# EAGLE schematic LabAccessDC (EAGLE 9.2.1)
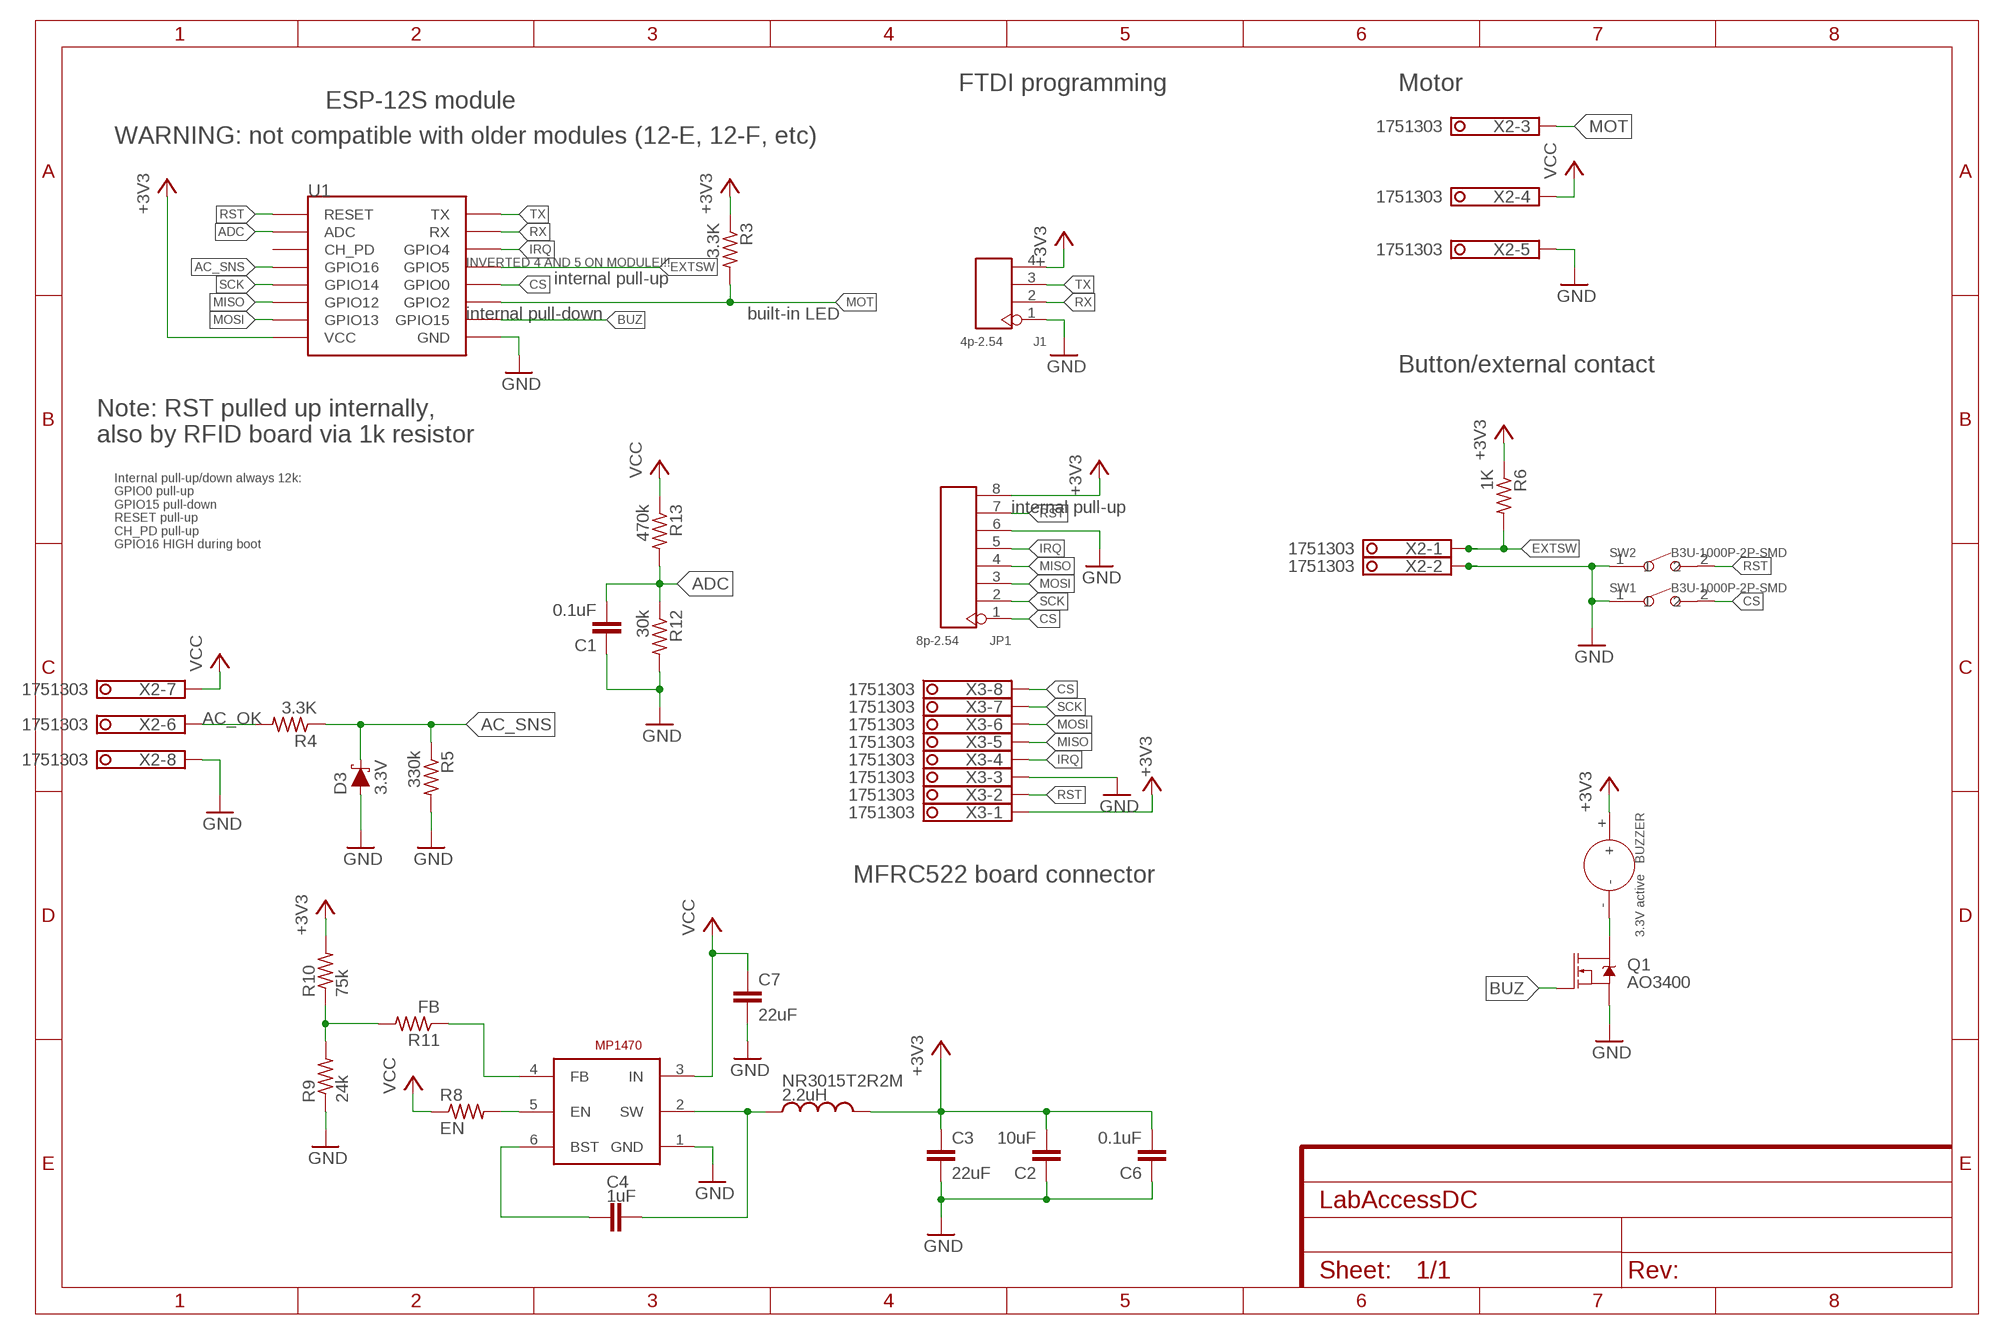
[diagram p0: schematic, sheet 1]

## Parts
BUZZER  3.3V active  DIP-BUZZER-3V(KS-12065D03YA)  [BZ2-7.6-D12.0XH6.5MM]
C1  0.1uF  C-EUC0603K  [C0603K]
C2  10uF  C-EUC0805K  [C0805K]
C3  22uF  C-EUC0805K  [C0805K]
C4  1uF  C-EUC0603K  [C0603K]
C6  0.1uF  C-EUC0603K  [C0603K]
C7  22uF  C-EUC0805K  [C0805K]
D3  3.3V  SPARKFUN-DISCRETESEMI_DIODE-SCHOTTKY-RB751S40  [SPARKFUN-DISCRETESEMI_SOD-523]
J1  4p-2.54  DIP-BLACK-MALE-HEADER-VERT(4P-2.54)  [H4-2.54]
JP1  8p-2.54  DIP-BLACK-MALE-HEADER-VERT(8P-2.54)  [H8-2.54]
MP1470  MP1470GJ  [TSOT-23-6]
NR3015T2R2M  2.2uH  INDUCTORB  [INDUCTOR-NR3015]
Q1  AO3400  MOSFET-NCH-AO3404A  [SOT23-3]
R3  3.3K  R-US_R0603  [R0603]
R4  3.3K  R-US_R0603  [R0603]
R5  330k  R-US_R0603  [R0603]
R6  1K  R-US_R0603  [R0603]
R8  EN  R-US_R0603  [R0603]
R9  24k  R-US_R0603  [R0603]
R10  75k  R-US_R0603  [R0603]
R11  FB  R-US_R0603  [R0603]
R12  30k  R-US_R0603  [R0603]
R13  470k  R-US_R0603  [R0603]
SW1  B3U-1000P-2P-SMD  SMD-BUTTON(2P-3.0X2.5X1.2+0.4MM)-B3U-1000P-2P-SMD  [SW2-2.6-3.0X2.5X1.2+0.4MM]
SW2  B3U-1000P-2P-SMD  SMD-BUTTON(2P-3.0X2.5X1.2+0.4MM)-B3U-1000P-2P-SMD  [SW2-2.6-3.0X2.5X1.2+0.4MM]
U1  ESP12SMD  [ESP12-SMD]
X2  1751303  [1751303]
X3  1751303  [1751303]

## Nets
+3V3: BUZZER.+ C2.2 C3.1 C6.2 J1.4 JP1.8 NR3015T2R2M.2 R3.1 R6.1 R10.2 U1.VCC X3.1
AC_OK: R4.2 X2.6
AC_SNS: D3.C R4.1 R5.1 U1.GPIO16
ADC: C1.2 R12.1 R13.2 U1.ADC
BUZ: Q1.1(G) U1.GPIO15
CS: JP1.1 SW1.2 U1.GPIO0 X3.8
EXTSW: R6.2 U1.GPIO5 X2.1
GND: C1.1 C2.1 C3.2 C6.1 C7.2 D3.A J1.1 JP1.6 MP1470.1(GND) Q1.2(S) R5.2 R9.1 R12.2 SW1.1 SW2.1 U1.GND X2.2 X2.5 X2.8 X3.3
IRQ: JP1.5 U1.GPIO4 X3.4
MISO: JP1.4 U1.GPIO12 X3.5
MOSI: JP1.3 U1.GPIO13 X3.6
MOT: R3.2 U1.GPIO2 X2.3
N$1: BUZZER.- Q1.3(D)
N$7: C4.1 MP1470.6(BST)
N$10: C4.2 MP1470.2(SW) NR3015T2R2M.1
N$11: MP1470.5(EN) R8.2
N$12: R9.2 R10.1 R11.2
N$13: MP1470.4(FB) R11.1
RST: JP1.7 SW2.2 U1.RESET X3.2
RX: J1.2 U1.RXD0(RX)
SCK: JP1.2 U1.GPIO14 X3.7
TX: J1.3 U1.TXD0(TX)
VCC: C7.1 MP1470.3(IN) R8.1 R13.1 X2.4 X2.7
Unconnected: U1.CH_PD

## Notes on the sheet
- FTDI programming | Motor
- ESP-12S module
- WARNING: not compatible with older modules (12-E, 12-F, etc)
- INVERTED 4 AND 5 ON MODULE!!!
- internal pull-up
- internal pull-down | built-in LED
- Button/external contact
- Note: RST pulled up internally,
  also by RFID board via 1k resistor
- internal pull-up
- Internal pull-up/down always 12k:
  GPIO0 pull-up
  GPIO15 pull-down
  RESET pull-up
  CH_PD pull-up
  GPIO16 HIGH during boot
- MFRC522 board connector

## Library data of the parts
BUZZER = Seeed-Connector:DIP-BUZZER-3V(KS-12065D03YA): 312010004; MPN: KS-12065D03YA; VALUE: KS-12065D03YA
C1-C4 C6 C7 = rcl:C-EU: CAPACITOR, European symbol; SPICEPREFIX: C
D3 = LabAccessBoard:SPARKFUN-DISCRETESEMI_DIODE-SCHOTTKY: Schottky diode A Schottky diode is a semiconductor diode which has a low forward voltage drop and a very fast switching action.; PROD_ID: DIO-11018; SPICEPREFIX: D; VALUE: 120mA/40V/370mV
J1 = Seeed-Connector:DIP-BLACK-MALE-HEADER-VERT(4P-2.54): 320020017; MPN: P125-1104A0BS116A1
JP1 = Seeed-Connector:DIP-BLACK-MALE-HEADER-VERT(8P-2.54): 320020080; MPN: P125-1108A1BS116A1
MP1470 = MP1470:MP1470GJ
NR3015T2R2M = Particle:INDUCTOR
Q1 = SparkFun-DiscreteSemi:MOSFET-NCH: N-channel MOSFETs Voltage controlled devices that allow control of high current outputs. SparkFun Products: SparkFun OpenScale <https://www.sparkfun.com/products/13261> SparkFun Digital Sandbox <https://www.sparkfun.com/products/12651> SparkFun Monster Moto Shield <https://www.sparkfun.com/products/10182> SparkFun MOSFET Power Controller <https://www.sparkfun.com/products/11214>; PROD_ID: TRANS-12988; VALUE: 5.8A/30V/35mΩ
R3 R6 = resistor:R-US_: RESISTOR, American symbol
R4 R5 R8-R13 = rcl:R-US_: RESISTOR, American symbol; SPICEPREFIX: R
SW1 SW2 = Seeed-Switch:SMD-BUTTON(2P-3.0X2.5X1.2+0.4MM): 311020047; MPN: B3U-1000P-2P-SMD
U1 = esp8266modules:ESP12: ESP8266 Wifi module 12
X2 X3 = con-phoenix-350:1751303: MKDS 1/ 8-3,5 Printklemme Nennstrom: 10 A Bemessungsspannung: 160 V Raster: 3,5 mm Polzahl: 8 Montageart: Löten Anschlussart: Schraubanschluss Anschlussrichtung vom Leiter zur Platine: 0° Source: http://eshop.phoenixcontact.com .. .pdf; OC_FARNELL: unknown; OC_NEWARK: unknown